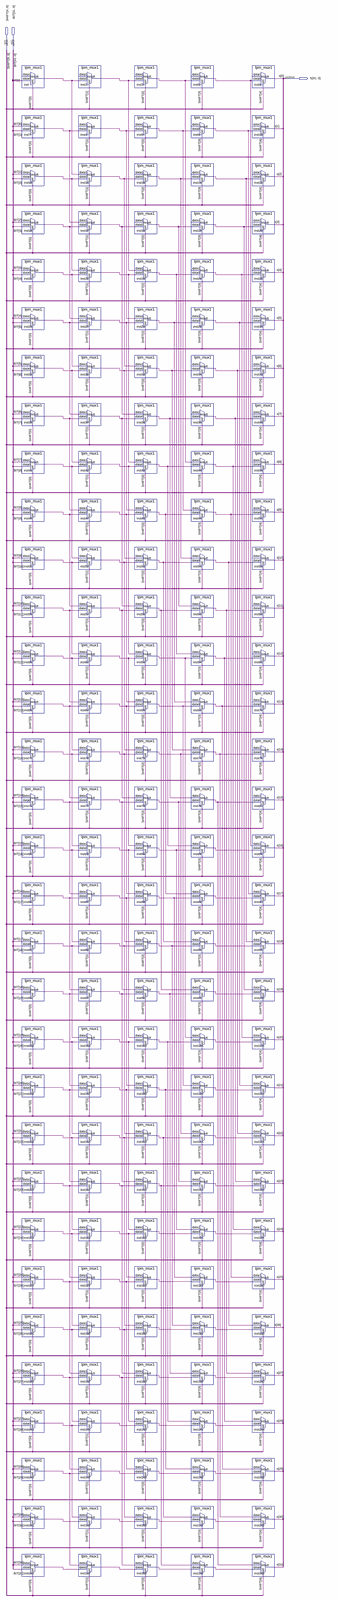
[diagram p0: schematic sheet, whole]
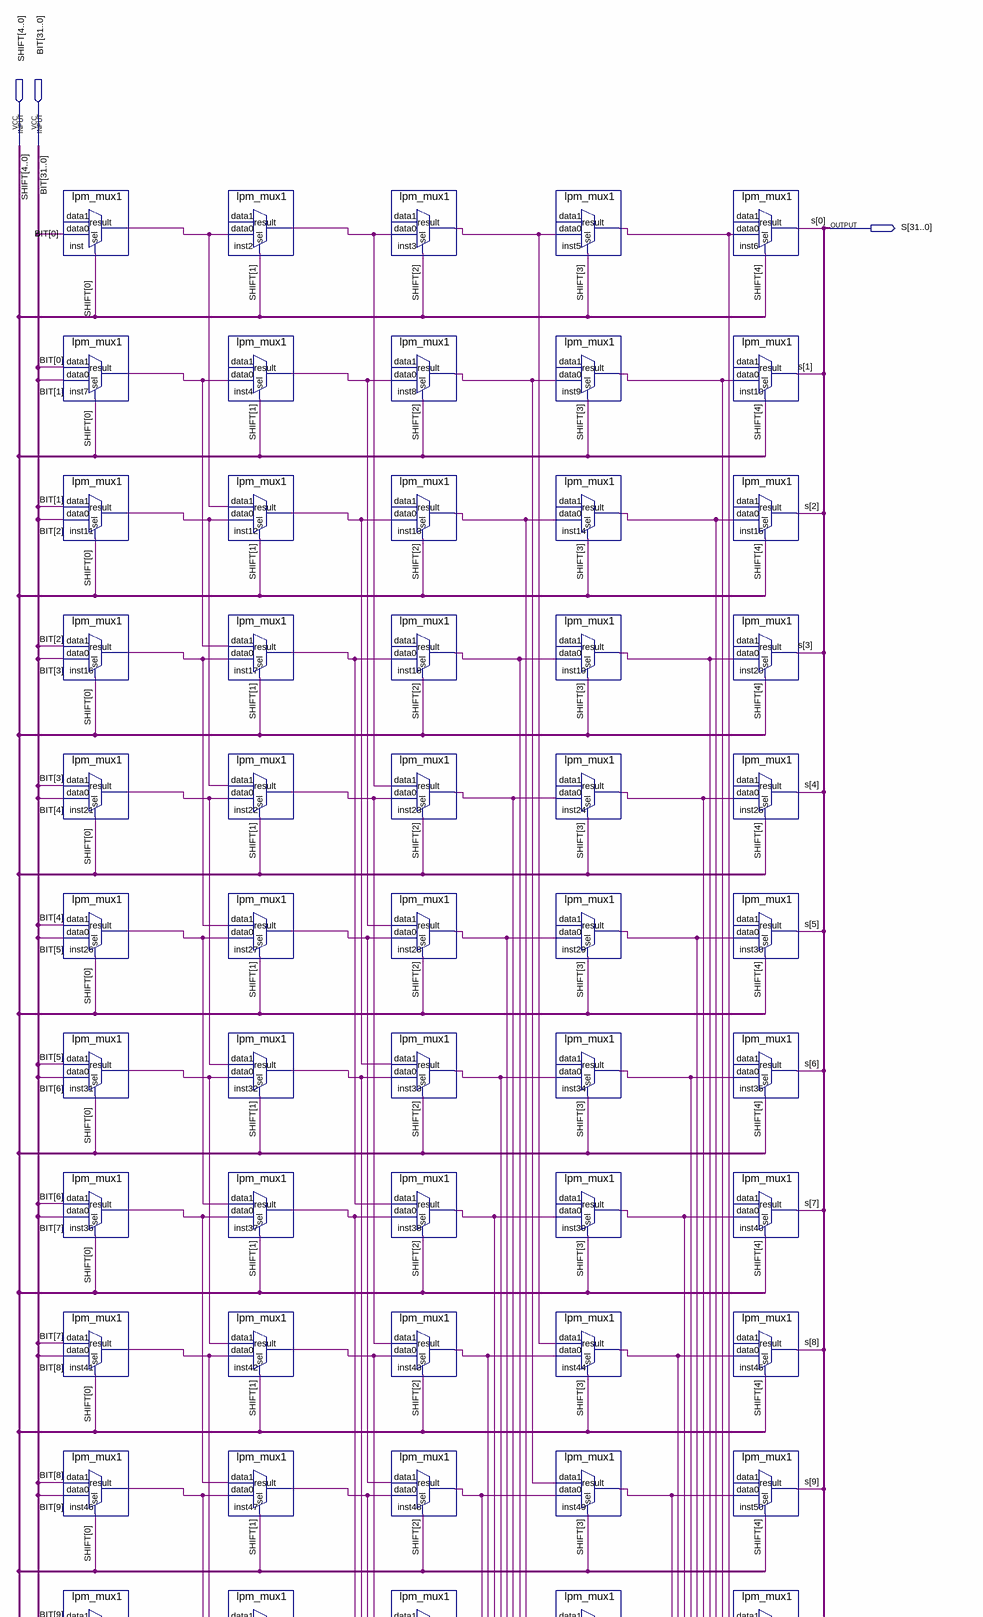
[diagram p1: schematic sheet, upper part]
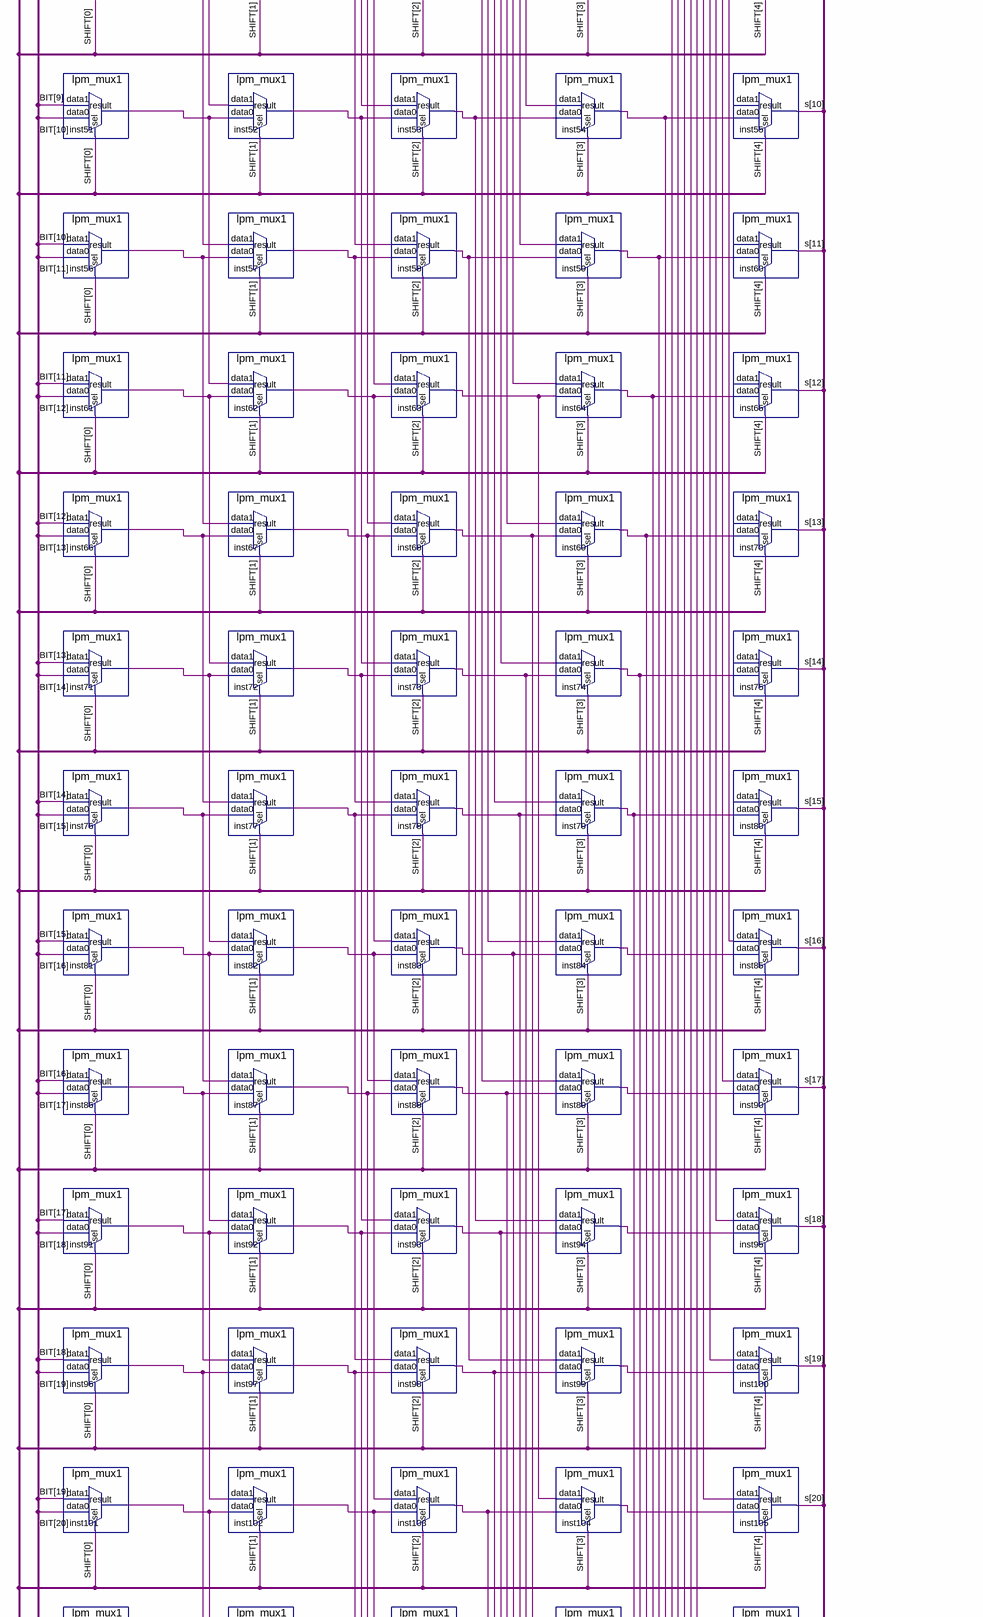
[diagram p2: schematic sheet, middle part]
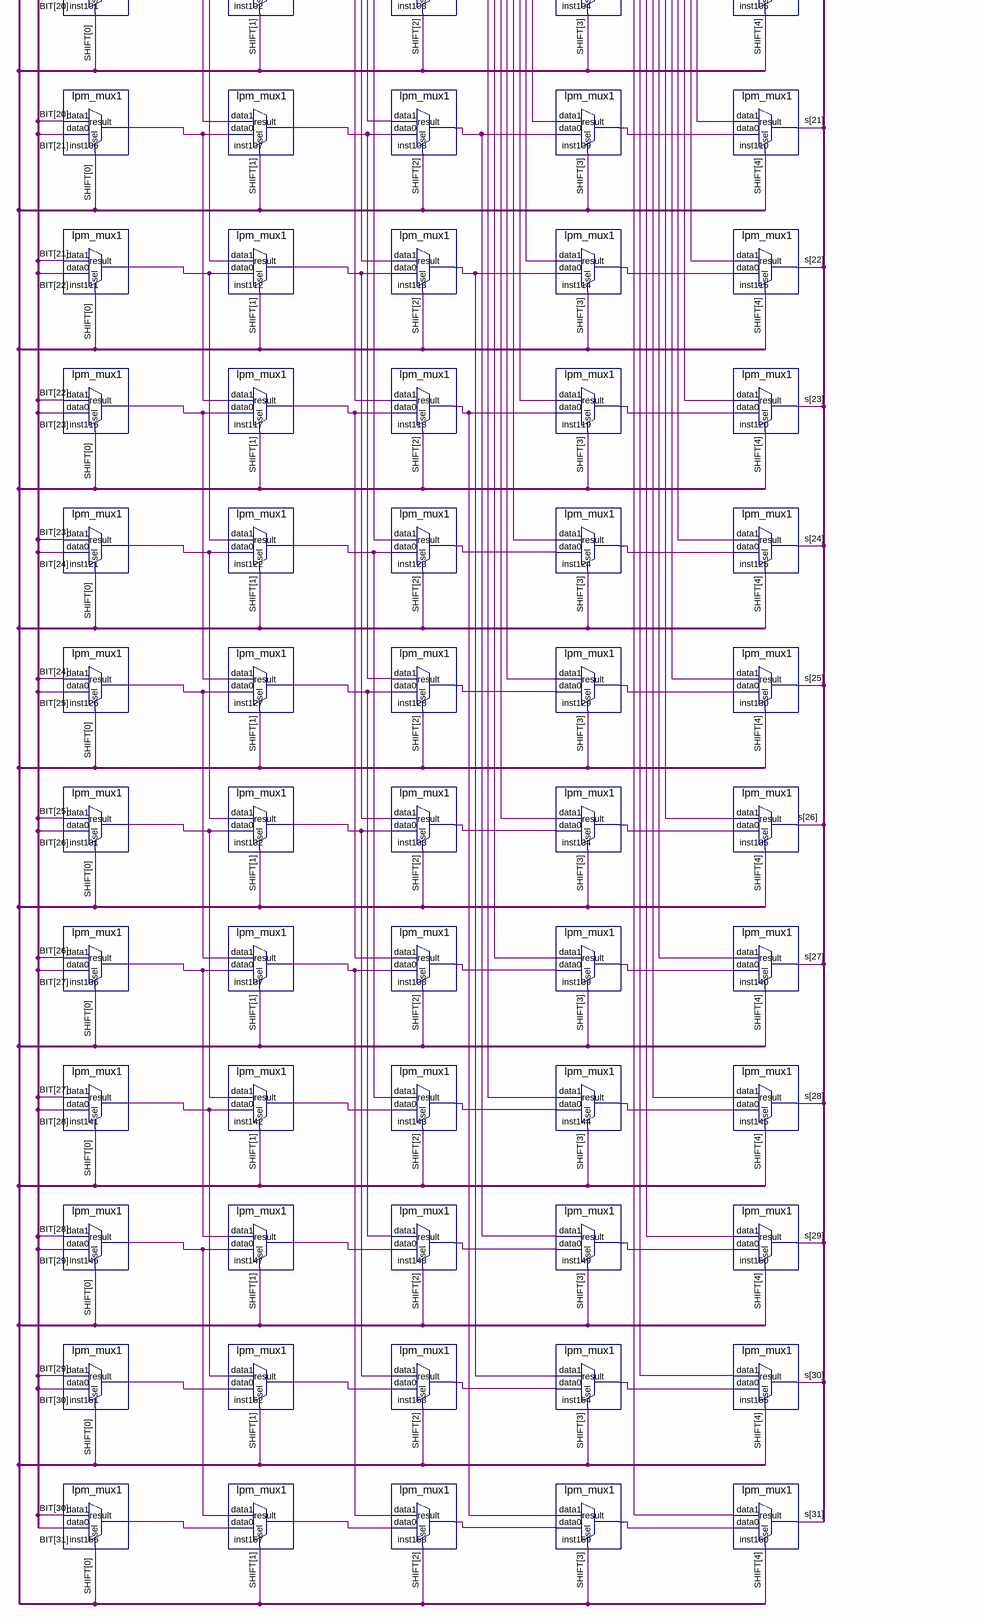
[diagram p3: schematic sheet, lower part]
// Quartus schematic SLL.bdf as structural Verilog: 160 symbols, 3 pins
module SLL (
  input  [4:0] SHIFT,
  input  [31:0] BIT,
  output [31:0] S
);

  wire inst2_result, inst3_result, inst4_result, inst5_result, inst7_result, inst8_result, inst9_result,
       inst11_result, inst12_result, inst13_result, inst14_result, inst16_result, inst17_result,
       inst18_result, inst19_result, inst21_result, inst22_result, inst23_result, inst24_result,
       inst26_result, inst27_result, inst28_result, inst29_result, inst31_result, inst32_result,
       inst33_result, inst34_result, inst36_result, inst37_result, inst38_result, inst39_result,
       inst41_result, inst42_result, inst43_result, inst44_result, inst46_result, inst47_result,
       inst48_result, inst49_result, inst51_result, inst52_result, inst53_result, inst54_result,
       inst56_result, inst57_result, inst58_result, inst59_result, inst61_result, inst62_result,
       inst63_result, inst64_result, inst66_result, inst67_result, inst68_result, inst69_result,
       inst71_result, inst72_result, inst73_result, inst74_result, inst76_result, inst77_result,
       inst78_result, inst79_result, inst81_result, inst82_result, inst83_result, inst84_result,
       inst86_result, inst87_result, inst88_result, inst89_result, inst91_result, inst92_result,
       inst93_result, inst94_result, inst96_result, inst97_result, inst98_result, inst99_result,
       inst101_result, inst102_result, inst103_result, inst104_result, inst106_result, inst107_result,
       inst108_result, inst109_result, inst111_result, inst112_result, inst113_result, inst114_result,
       inst116_result, inst117_result, inst118_result, inst119_result, inst121_result, inst122_result,
       inst123_result, inst124_result, inst126_result, inst127_result, inst128_result, inst129_result,
       inst131_result, inst132_result, inst133_result, inst134_result, inst136_result, inst137_result,
       inst138_result, inst139_result, inst141_result, inst142_result, inst143_result, inst144_result,
       inst146_result, inst147_result, inst148_result, inst149_result, inst151_result, inst152_result,
       inst153_result, inst154_result, inst156_result, inst157_result, inst158_result, inst159_result,
       inst_result;

  lpm_mux1 inst (.data0(BIT[0]), .sel(SHIFT[0]), .result(inst_result));  // open: data1
  lpm_mux1 inst7 (.data1(BIT[0]), .data0(BIT[1]), .sel(SHIFT[0]), .result(inst7_result));
  lpm_mux1 inst11 (.data1(BIT[1]), .data0(BIT[2]), .sel(SHIFT[0]), .result(inst11_result));
  lpm_mux1 inst16 (.data1(BIT[2]), .data0(BIT[3]), .sel(SHIFT[0]), .result(inst16_result));
  lpm_mux1 inst21 (.data1(BIT[3]), .data0(BIT[4]), .sel(SHIFT[0]), .result(inst21_result));
  lpm_mux1 inst26 (.data1(BIT[4]), .data0(BIT[5]), .sel(SHIFT[0]), .result(inst26_result));
  lpm_mux1 inst31 (.data1(BIT[5]), .data0(BIT[6]), .sel(SHIFT[0]), .result(inst31_result));
  lpm_mux1 inst36 (.data1(BIT[6]), .data0(BIT[7]), .sel(SHIFT[0]), .result(inst36_result));
  lpm_mux1 inst41 (.data1(BIT[7]), .data0(BIT[8]), .sel(SHIFT[0]), .result(inst41_result));
  lpm_mux1 inst46 (.data1(BIT[8]), .data0(BIT[9]), .sel(SHIFT[0]), .result(inst46_result));
  lpm_mux1 inst51 (.data1(BIT[9]), .data0(BIT[10]), .sel(SHIFT[0]), .result(inst51_result));
  lpm_mux1 inst56 (.data1(BIT[10]), .data0(BIT[11]), .sel(SHIFT[0]), .result(inst56_result));
  lpm_mux1 inst61 (.data1(BIT[11]), .data0(BIT[12]), .sel(SHIFT[0]), .result(inst61_result));
  lpm_mux1 inst66 (.data1(BIT[12]), .data0(BIT[13]), .sel(SHIFT[0]), .result(inst66_result));
  lpm_mux1 inst71 (.data1(BIT[13]), .data0(BIT[14]), .sel(SHIFT[0]), .result(inst71_result));
  lpm_mux1 inst76 (.data1(BIT[14]), .data0(BIT[15]), .sel(SHIFT[0]), .result(inst76_result));
  lpm_mux1 inst81 (.data1(BIT[15]), .data0(BIT[16]), .sel(SHIFT[0]), .result(inst81_result));
  lpm_mux1 inst86 (.data1(BIT[16]), .data0(BIT[17]), .sel(SHIFT[0]), .result(inst86_result));
  lpm_mux1 inst91 (.data1(BIT[17]), .data0(BIT[18]), .sel(SHIFT[0]), .result(inst91_result));
  lpm_mux1 inst96 (.data1(BIT[18]), .data0(BIT[19]), .sel(SHIFT[0]), .result(inst96_result));
  lpm_mux1 inst101 (.data1(BIT[19]), .data0(BIT[20]), .sel(SHIFT[0]), .result(inst101_result));
  lpm_mux1 inst106 (.data1(BIT[20]), .data0(BIT[21]), .sel(SHIFT[0]), .result(inst106_result));
  lpm_mux1 inst111 (.data1(BIT[21]), .data0(BIT[22]), .sel(SHIFT[0]), .result(inst111_result));
  lpm_mux1 inst116 (.data1(BIT[22]), .data0(BIT[23]), .sel(SHIFT[0]), .result(inst116_result));
  lpm_mux1 inst121 (.data1(BIT[23]), .data0(BIT[24]), .sel(SHIFT[0]), .result(inst121_result));
  lpm_mux1 inst126 (.data1(BIT[24]), .data0(BIT[25]), .sel(SHIFT[0]), .result(inst126_result));
  lpm_mux1 inst131 (.data1(BIT[25]), .data0(BIT[26]), .sel(SHIFT[0]), .result(inst131_result));
  lpm_mux1 inst136 (.data1(BIT[26]), .data0(BIT[27]), .sel(SHIFT[0]), .result(inst136_result));
  lpm_mux1 inst141 (.data1(BIT[27]), .data0(BIT[28]), .sel(SHIFT[0]), .result(inst141_result));
  lpm_mux1 inst146 (.data1(BIT[28]), .data0(BIT[29]), .sel(SHIFT[0]), .result(inst146_result));
  lpm_mux1 inst151 (.data1(BIT[29]), .data0(BIT[30]), .sel(SHIFT[0]), .result(inst151_result));
  lpm_mux1 inst156 (.data1(BIT[30]), .data0(BIT[31]), .sel(SHIFT[0]), .result(inst156_result));
  lpm_mux1 inst2 (.data0(inst_result), .sel(SHIFT[1]), .result(inst2_result));  // open: data1
  lpm_mux1 inst4 (.data0(inst7_result), .sel(SHIFT[1]), .result(inst4_result));  // open: data1
  lpm_mux1 inst12 (.data1(inst_result), .data0(inst11_result), .sel(SHIFT[1]), .result(inst12_result));
  lpm_mux1 inst17 (.data1(inst7_result), .data0(inst16_result), .sel(SHIFT[1]), .result(inst17_result));
  lpm_mux1 inst22 (.data1(inst11_result), .data0(inst21_result), .sel(SHIFT[1]), .result(inst22_result));
  lpm_mux1 inst27 (.data1(inst16_result), .data0(inst26_result), .sel(SHIFT[1]), .result(inst27_result));
  lpm_mux1 inst32 (.data1(inst21_result), .data0(inst31_result), .sel(SHIFT[1]), .result(inst32_result));
  lpm_mux1 inst37 (.data1(inst26_result), .data0(inst36_result), .sel(SHIFT[1]), .result(inst37_result));
  lpm_mux1 inst42 (.data1(inst31_result), .data0(inst41_result), .sel(SHIFT[1]), .result(inst42_result));
  lpm_mux1 inst47 (.data1(inst36_result), .data0(inst46_result), .sel(SHIFT[1]), .result(inst47_result));
  lpm_mux1 inst52 (.data1(inst41_result), .data0(inst51_result), .sel(SHIFT[1]), .result(inst52_result));
  lpm_mux1 inst57 (.data1(inst46_result), .data0(inst56_result), .sel(SHIFT[1]), .result(inst57_result));
  lpm_mux1 inst62 (.data1(inst51_result), .data0(inst61_result), .sel(SHIFT[1]), .result(inst62_result));
  lpm_mux1 inst67 (.data1(inst56_result), .data0(inst66_result), .sel(SHIFT[1]), .result(inst67_result));
  lpm_mux1 inst72 (.data1(inst61_result), .data0(inst71_result), .sel(SHIFT[1]), .result(inst72_result));
  lpm_mux1 inst77 (.data1(inst66_result), .data0(inst76_result), .sel(SHIFT[1]), .result(inst77_result));
  lpm_mux1 inst82 (.data1(inst71_result), .data0(inst81_result), .sel(SHIFT[1]), .result(inst82_result));
  lpm_mux1 inst87 (.data1(inst76_result), .data0(inst86_result), .sel(SHIFT[1]), .result(inst87_result));
  lpm_mux1 inst92 (.data1(inst81_result), .data0(inst91_result), .sel(SHIFT[1]), .result(inst92_result));
  lpm_mux1 inst97 (.data1(inst86_result), .data0(inst96_result), .sel(SHIFT[1]), .result(inst97_result));
  lpm_mux1 inst102 (.data1(inst91_result), .data0(inst101_result), .sel(SHIFT[1]), .result(inst102_result));
  lpm_mux1 inst107 (.data1(inst96_result), .data0(inst106_result), .sel(SHIFT[1]), .result(inst107_result));
  lpm_mux1 inst112 (.data1(inst101_result), .data0(inst111_result), .sel(SHIFT[1]), .result(inst112_result));
  lpm_mux1 inst117 (.data1(inst106_result), .data0(inst116_result), .sel(SHIFT[1]), .result(inst117_result));
  lpm_mux1 inst122 (.data1(inst111_result), .data0(inst121_result), .sel(SHIFT[1]), .result(inst122_result));
  lpm_mux1 inst127 (.data1(inst116_result), .data0(inst126_result), .sel(SHIFT[1]), .result(inst127_result));
  lpm_mux1 inst132 (.data1(inst121_result), .data0(inst131_result), .sel(SHIFT[1]), .result(inst132_result));
  lpm_mux1 inst137 (.data1(inst126_result), .data0(inst136_result), .sel(SHIFT[1]), .result(inst137_result));
  lpm_mux1 inst142 (.data1(inst131_result), .data0(inst141_result), .sel(SHIFT[1]), .result(inst142_result));
  lpm_mux1 inst147 (.data1(inst136_result), .data0(inst146_result), .sel(SHIFT[1]), .result(inst147_result));
  lpm_mux1 inst152 (.data1(inst141_result), .data0(inst151_result), .sel(SHIFT[1]), .result(inst152_result));
  lpm_mux1 inst157 (.data1(inst146_result), .data0(inst156_result), .sel(SHIFT[1]), .result(inst157_result));
  lpm_mux1 inst3 (.data0(inst2_result), .sel(SHIFT[2]), .result(inst3_result));  // open: data1
  lpm_mux1 inst8 (.data0(inst4_result), .sel(SHIFT[2]), .result(inst8_result));  // open: data1
  lpm_mux1 inst13 (.data0(inst12_result), .sel(SHIFT[2]), .result(inst13_result));  // open: data1
  lpm_mux1 inst18 (.data0(inst17_result), .sel(SHIFT[2]), .result(inst18_result));  // open: data1
  lpm_mux1 inst23 (.data1(inst2_result), .data0(inst22_result), .sel(SHIFT[2]), .result(inst23_result));
  lpm_mux1 inst28 (.data1(inst4_result), .data0(inst27_result), .sel(SHIFT[2]), .result(inst28_result));
  lpm_mux1 inst33 (.data1(inst12_result), .data0(inst32_result), .sel(SHIFT[2]), .result(inst33_result));
  lpm_mux1 inst38 (.data1(inst17_result), .data0(inst37_result), .sel(SHIFT[2]), .result(inst38_result));
  lpm_mux1 inst43 (.data1(inst22_result), .data0(inst42_result), .sel(SHIFT[2]), .result(inst43_result));
  lpm_mux1 inst48 (.data1(inst27_result), .data0(inst47_result), .sel(SHIFT[2]), .result(inst48_result));
  lpm_mux1 inst53 (.data1(inst32_result), .data0(inst52_result), .sel(SHIFT[2]), .result(inst53_result));
  lpm_mux1 inst58 (.data1(inst37_result), .data0(inst57_result), .sel(SHIFT[2]), .result(inst58_result));
  lpm_mux1 inst63 (.data1(inst42_result), .data0(inst62_result), .sel(SHIFT[2]), .result(inst63_result));
  lpm_mux1 inst68 (.data1(inst47_result), .data0(inst67_result), .sel(SHIFT[2]), .result(inst68_result));
  lpm_mux1 inst73 (.data1(inst52_result), .data0(inst72_result), .sel(SHIFT[2]), .result(inst73_result));
  lpm_mux1 inst78 (.data1(inst57_result), .data0(inst77_result), .sel(SHIFT[2]), .result(inst78_result));
  lpm_mux1 inst83 (.data1(inst62_result), .data0(inst82_result), .sel(SHIFT[2]), .result(inst83_result));
  lpm_mux1 inst88 (.data1(inst67_result), .data0(inst87_result), .sel(SHIFT[2]), .result(inst88_result));
  lpm_mux1 inst93 (.data1(inst72_result), .data0(inst92_result), .sel(SHIFT[2]), .result(inst93_result));
  lpm_mux1 inst98 (.data1(inst77_result), .data0(inst97_result), .sel(SHIFT[2]), .result(inst98_result));
  lpm_mux1 inst103 (.data1(inst82_result), .data0(inst102_result), .sel(SHIFT[2]), .result(inst103_result));
  lpm_mux1 inst108 (.data1(inst87_result), .data0(inst107_result), .sel(SHIFT[2]), .result(inst108_result));
  lpm_mux1 inst113 (.data1(inst92_result), .data0(inst112_result), .sel(SHIFT[2]), .result(inst113_result));
  lpm_mux1 inst118 (.data1(inst97_result), .data0(inst117_result), .sel(SHIFT[2]), .result(inst118_result));
  lpm_mux1 inst123 (.data1(inst102_result), .data0(inst122_result), .sel(SHIFT[2]), .result(inst123_result));
  lpm_mux1 inst128 (.data1(inst107_result), .data0(inst127_result), .sel(SHIFT[2]), .result(inst128_result));
  lpm_mux1 inst133 (.data1(inst112_result), .data0(inst132_result), .sel(SHIFT[2]), .result(inst133_result));
  lpm_mux1 inst138 (.data1(inst117_result), .data0(inst137_result), .sel(SHIFT[2]), .result(inst138_result));
  lpm_mux1 inst143 (.data1(inst122_result), .data0(inst142_result), .sel(SHIFT[2]), .result(inst143_result));
  lpm_mux1 inst148 (.data1(inst127_result), .data0(inst147_result), .sel(SHIFT[2]), .result(inst148_result));
  lpm_mux1 inst153 (.data1(inst132_result), .data0(inst152_result), .sel(SHIFT[2]), .result(inst153_result));
  lpm_mux1 inst158 (.data1(inst137_result), .data0(inst157_result), .sel(SHIFT[2]), .result(inst158_result));
  lpm_mux1 inst5 (.data0(inst3_result), .sel(SHIFT[3]), .result(inst5_result));  // open: data1
  lpm_mux1 inst9 (.data0(inst8_result), .sel(SHIFT[3]), .result(inst9_result));  // open: data1
  lpm_mux1 inst14 (.data0(inst13_result), .sel(SHIFT[3]), .result(inst14_result));  // open: data1
  lpm_mux1 inst19 (.data0(inst18_result), .sel(SHIFT[3]), .result(inst19_result));  // open: data1
  lpm_mux1 inst24 (.data0(inst23_result), .sel(SHIFT[3]), .result(inst24_result));  // open: data1
  lpm_mux1 inst29 (.data0(inst28_result), .sel(SHIFT[3]), .result(inst29_result));  // open: data1
  lpm_mux1 inst34 (.data0(inst33_result), .sel(SHIFT[3]), .result(inst34_result));  // open: data1
  lpm_mux1 inst39 (.data0(inst38_result), .sel(SHIFT[3]), .result(inst39_result));  // open: data1
  lpm_mux1 inst44 (.data1(inst3_result), .data0(inst43_result), .sel(SHIFT[3]), .result(inst44_result));
  lpm_mux1 inst49 (.data1(inst8_result), .data0(inst48_result), .sel(SHIFT[3]), .result(inst49_result));
  lpm_mux1 inst54 (.data1(inst13_result), .data0(inst53_result), .sel(SHIFT[3]), .result(inst54_result));
  lpm_mux1 inst59 (.data1(inst18_result), .data0(inst58_result), .sel(SHIFT[3]), .result(inst59_result));
  lpm_mux1 inst64 (.data1(inst23_result), .data0(inst63_result), .sel(SHIFT[3]), .result(inst64_result));
  lpm_mux1 inst69 (.data1(inst28_result), .data0(inst68_result), .sel(SHIFT[3]), .result(inst69_result));
  lpm_mux1 inst74 (.data1(inst33_result), .data0(inst73_result), .sel(SHIFT[3]), .result(inst74_result));
  lpm_mux1 inst79 (.data1(inst38_result), .data0(inst78_result), .sel(SHIFT[3]), .result(inst79_result));
  lpm_mux1 inst84 (.data1(inst43_result), .data0(inst83_result), .sel(SHIFT[3]), .result(inst84_result));
  lpm_mux1 inst89 (.data1(inst48_result), .data0(inst88_result), .sel(SHIFT[3]), .result(inst89_result));
  lpm_mux1 inst94 (.data1(inst53_result), .data0(inst93_result), .sel(SHIFT[3]), .result(inst94_result));
  lpm_mux1 inst99 (.data1(inst58_result), .data0(inst98_result), .sel(SHIFT[3]), .result(inst99_result));
  lpm_mux1 inst104 (.data1(inst63_result), .data0(inst103_result), .sel(SHIFT[3]), .result(inst104_result));
  lpm_mux1 inst109 (.data1(inst68_result), .data0(inst108_result), .sel(SHIFT[3]), .result(inst109_result));
  lpm_mux1 inst114 (.data1(inst73_result), .data0(inst113_result), .sel(SHIFT[3]), .result(inst114_result));
  lpm_mux1 inst119 (.data1(inst78_result), .data0(inst118_result), .sel(SHIFT[3]), .result(inst119_result));
  lpm_mux1 inst124 (.data1(inst83_result), .data0(inst123_result), .sel(SHIFT[3]), .result(inst124_result));
  lpm_mux1 inst129 (.data1(inst88_result), .data0(inst128_result), .sel(SHIFT[3]), .result(inst129_result));
  lpm_mux1 inst134 (.data1(inst93_result), .data0(inst133_result), .sel(SHIFT[3]), .result(inst134_result));
  lpm_mux1 inst139 (.data1(inst98_result), .data0(inst138_result), .sel(SHIFT[3]), .result(inst139_result));
  lpm_mux1 inst144 (.data1(inst103_result), .data0(inst143_result), .sel(SHIFT[3]), .result(inst144_result));
  lpm_mux1 inst149 (.data1(inst108_result), .data0(inst148_result), .sel(SHIFT[3]), .result(inst149_result));
  lpm_mux1 inst154 (.data1(inst113_result), .data0(inst153_result), .sel(SHIFT[3]), .result(inst154_result));
  lpm_mux1 inst159 (.data1(inst118_result), .data0(inst158_result), .sel(SHIFT[3]), .result(inst159_result));
  lpm_mux1 inst6 (.data0(inst5_result), .sel(SHIFT[4]), .result(S[0]));  // open: data1
  lpm_mux1 inst10 (.data0(inst9_result), .sel(SHIFT[4]), .result(S[1]));  // open: data1
  lpm_mux1 inst15 (.data0(inst14_result), .sel(SHIFT[4]), .result(S[2]));  // open: data1
  lpm_mux1 inst20 (.data0(inst19_result), .sel(SHIFT[4]), .result(S[3]));  // open: data1
  lpm_mux1 inst25 (.data0(inst24_result), .sel(SHIFT[4]), .result(S[4]));  // open: data1
  lpm_mux1 inst30 (.data0(inst29_result), .sel(SHIFT[4]), .result(S[5]));  // open: data1
  lpm_mux1 inst35 (.data0(inst34_result), .sel(SHIFT[4]), .result(S[6]));  // open: data1
  lpm_mux1 inst40 (.data0(inst39_result), .sel(SHIFT[4]), .result(S[7]));  // open: data1
  lpm_mux1 inst45 (.data0(inst44_result), .sel(SHIFT[4]), .result(S[8]));  // open: data1
  lpm_mux1 inst50 (.data0(inst49_result), .sel(SHIFT[4]), .result(S[9]));  // open: data1
  lpm_mux1 inst55 (.data0(inst54_result), .sel(SHIFT[4]), .result(S[10]));  // open: data1
  lpm_mux1 inst60 (.data0(inst59_result), .sel(SHIFT[4]), .result(S[11]));  // open: data1
  lpm_mux1 inst65 (.data0(inst64_result), .sel(SHIFT[4]), .result(S[12]));  // open: data1
  lpm_mux1 inst70 (.data0(inst69_result), .sel(SHIFT[4]), .result(S[13]));  // open: data1
  lpm_mux1 inst75 (.data0(inst74_result), .sel(SHIFT[4]), .result(S[14]));  // open: data1
  lpm_mux1 inst80 (.data0(inst79_result), .sel(SHIFT[4]), .result(S[15]));  // open: data1
  lpm_mux1 inst85 (.data1(inst5_result), .data0(inst84_result), .sel(SHIFT[4]), .result(S[16]));
  lpm_mux1 inst90 (.data1(inst9_result), .data0(inst89_result), .sel(SHIFT[4]), .result(S[17]));
  lpm_mux1 inst95 (.data1(inst14_result), .data0(inst94_result), .sel(SHIFT[4]), .result(S[18]));
  lpm_mux1 inst100 (.data1(inst19_result), .data0(inst99_result), .sel(SHIFT[4]), .result(S[19]));
  lpm_mux1 inst105 (.data1(inst24_result), .data0(inst104_result), .sel(SHIFT[4]), .result(S[20]));
  lpm_mux1 inst110 (.data1(inst29_result), .data0(inst109_result), .sel(SHIFT[4]), .result(S[21]));
  lpm_mux1 inst115 (.data1(inst34_result), .data0(inst114_result), .sel(SHIFT[4]), .result(S[22]));
  lpm_mux1 inst120 (.data1(inst39_result), .data0(inst119_result), .sel(SHIFT[4]), .result(S[23]));
  lpm_mux1 inst125 (.data1(inst44_result), .data0(inst124_result), .sel(SHIFT[4]), .result(S[24]));
  lpm_mux1 inst130 (.data1(inst49_result), .data0(inst129_result), .sel(SHIFT[4]), .result(S[25]));
  lpm_mux1 inst135 (.data1(inst54_result), .data0(inst134_result), .sel(SHIFT[4]), .result(S[26]));
  lpm_mux1 inst140 (.data1(inst59_result), .data0(inst139_result), .sel(SHIFT[4]), .result(S[27]));
  lpm_mux1 inst145 (.data1(inst64_result), .data0(inst144_result), .sel(SHIFT[4]), .result(S[28]));
  lpm_mux1 inst150 (.data1(inst69_result), .data0(inst149_result), .sel(SHIFT[4]), .result(S[29]));
  lpm_mux1 inst155 (.data1(inst74_result), .data0(inst154_result), .sel(SHIFT[4]), .result(S[30]));
  lpm_mux1 inst160 (.data1(inst79_result), .data0(inst159_result), .sel(SHIFT[4]), .result(S[31]));
endmodule
